# EAGLE schematic GroundStationCR (EAGLE 7.7.0)
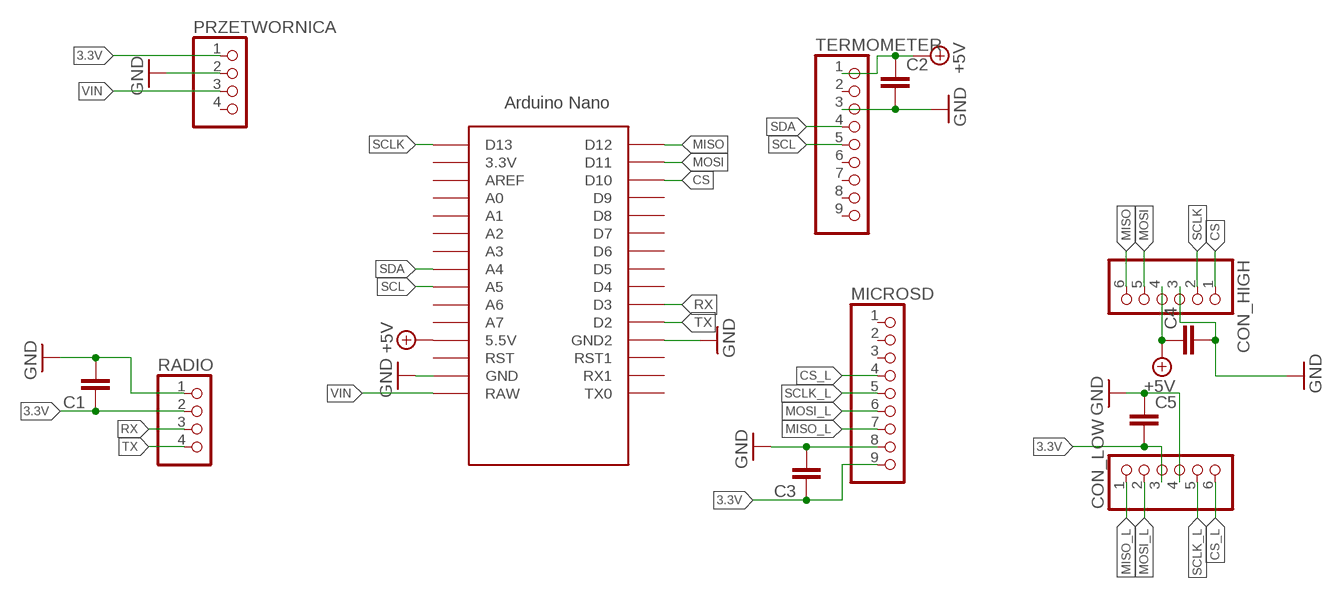
[diagram p0: schematic, sheet 1]

## Parts
C1  C-EU050-025X075  [C050-025X075]
C2  C-EU050-025X075  [C050-025X075]
C3  C-EU050-025X075  [C050-025X075]
C4  C-EU050-025X075  [C050-025X075]
C5  C-EU050-025X075  [C050-025X075]
CON_HIGH  PINHD-1X6  [1X06]
CON_LOW  PINHD-1X6  [1X06]
MICROSD  PINHD-1X9  [1X09]
PRZETWORNICA  PINHD-1X4  [1X04]
RADIO  PINHD-1X4  [1X04]
TERMOMETER  PINHD-1X9  [1X09]
U$1  NANO  [NANO]

## Nets
3.3V: C1.1 C3.1 C5.2 CON_LOW.3 MICROSD.9 PRZETWORNICA.1 RADIO.2
+5V: C2.1 C4.1 CON_HIGH.4 TERMOMETER.1 U$1.5V(5.5V)
CS: CON_HIGH.1 U$1.D10
CS_L: CON_LOW.6 MICROSD.4
GND: C1.2 C2.2 C3.2 C4.2 C5.1 CON_HIGH.3 CON_LOW.4 MICROSD.8 PRZETWORNICA.2 RADIO.1 TERMOMETER.3 U$1.GND U$1.GND1(GND2)
MISO: CON_HIGH.6 U$1.D12
MISO_L: CON_LOW.1 MICROSD.7
MOSI: CON_HIGH.5 U$1.D11
MOSI_L: CON_LOW.2 MICROSD.6
RX: RADIO.3 U$1.D3
SCL: TERMOMETER.5 U$1.A5
SCLK: CON_HIGH.2 U$1.D13
SCLK_L: CON_LOW.5 MICROSD.5
SDA: TERMOMETER.4 U$1.A4
TX: RADIO.4 U$1.D2
VIN: PRZETWORNICA.3 U$1.RAW
Unconnected: MICROSD.1 MICROSD.2 MICROSD.3 PRZETWORNICA.4 TERMOMETER.2 TERMOMETER.6 TERMOMETER.7 TERMOMETER.8 TERMOMETER.9 U$1.3.3V U$1.A0 U$1.A1 U$1.A2 U$1.A3 U$1.A6 U$1.A7 U$1.AREF U$1.D4 U$1.D5 U$1.D6 U$1.D7 U$1.D8 U$1.D9 U$1.ICSP1 U$1.ICSP2 U$1.ICSP3 U$1.ICSP4 U$1.ICSP5 U$1.ICSP6 U$1.RST U$1.RST1 U$1.RX1 U$1.TX0

## Library data of the parts
C1-C5 = resistor:C-EU: CAPACITOR, European symbol
CON_HIGH CON_LOW = pinhead:PINHD-1X6: PIN HEADER
MICROSD TERMOMETER = pinhead:PINHD-1X9: PIN HEADER
PRZETWORNICA RADIO = pinhead:PINHD-1X4: PIN HEADER
U$1 = Arduino-clone:NANO: Arduino Nano